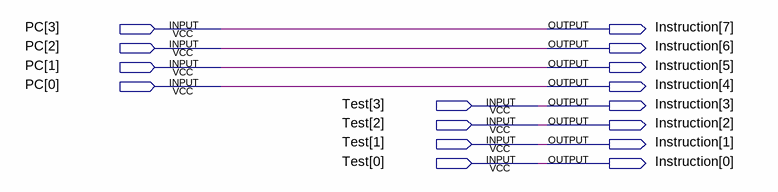
[diagram p0: schematic sheet]
// Quartus schematic InstMem.bdf as structural Verilog: 0 symbols, 16 pins
module InstMem (
  input  [3:0] PC,
  input  [3:0] Test,
  output [7:0] Instruction
);


  assign Instruction = {PC, Test};
endmodule
